# Altium schematic sheet 5.1 LC SEC Relay control.SchDoc
size A3
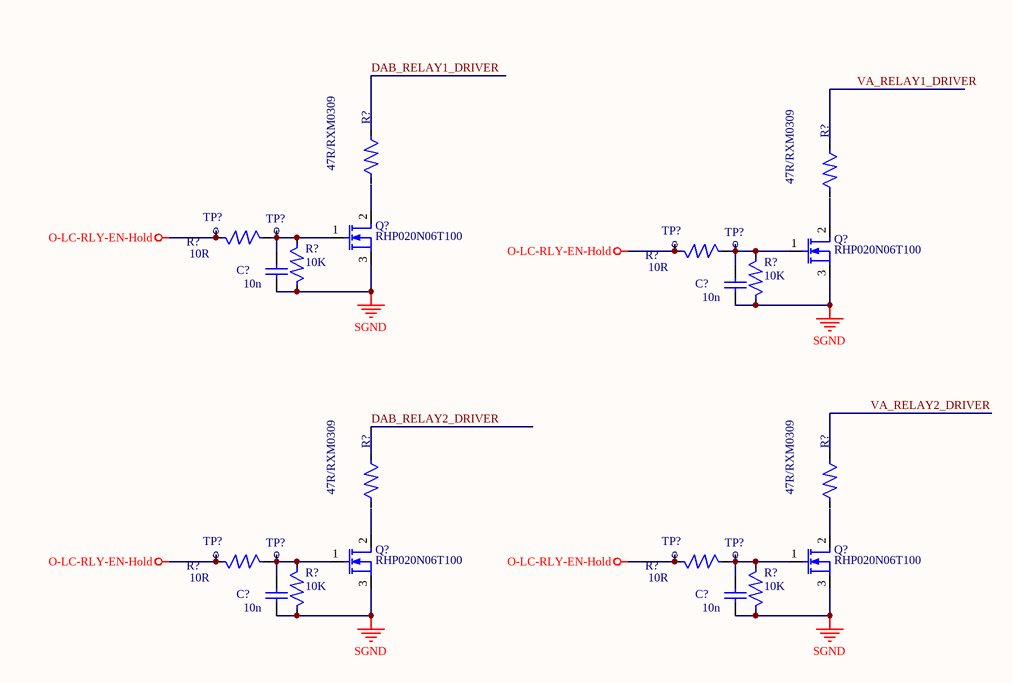
[diagram p0: 5.1 LC SEC Relay control.SchDoc]

## Parts
(Parts that share a designator on the sheet are numbered #1, #2 ... from top to bottom, then left to right.)
C?#1  10n  [C0402]
C?#2  10n  [C0402]
C?#3  10n  [C0402]
C?#4  10n  [C0402]
Q?#1  RHP020N06T100  [SOT89_MI]
Q?#2  RHP020N06T100  [SOT89_MI]
Q?#3  RHP020N06T100  [SOT89_MI]
Q?#4  RHP020N06T100  [SOT89_MI]
R?#1  47R/RXM0309  [RXM0309]
R?#2  47R/RXM0309  [RXM0309]
R?#3  10R  [R0402]
R?#4  10K  [R0402]
R?#5  10R  [R0402]
R?#6  10K  [R0402]
R?#7  47R/RXM0309  [RXM0309]
R?#8  47R/RXM0309  [RXM0309]
R?#9  10R  [R0402]
R?#10  10K  [R0402]
R?#11  10R  [R0402]
R?#12  10K  [R0402]
TP?#1  测试点  [测试点]  (value not drawn)
TP?#2  测试点  [测试点]  (value not drawn)
TP?#3  测试点  [测试点]  (value not drawn)
TP?#4  测试点  [测试点]  (value not drawn)
TP?#5  测试点  [测试点]  (value not drawn)
TP?#6  测试点  [测试点]  (value not drawn)
TP?#7  测试点  [测试点]  (value not drawn)
TP?#8  测试点  [测试点]  (value not drawn)

## Nets
O-LC-RLY-EN-Hold: R?#3.2 R?#5.2 R?#9.2 R?#11.2 TP?#1.1 TP?#3.1 TP?#5.1 TP?#7.1
SGND: C?#1.2 C?#2.2 C?#3.2 C?#4.2 Q?#1.3(S) Q?#2.3(S) Q?#3.3(S) Q?#4.3(S) R?#4.2 R?#6.2 R?#10.2 R?#12.2
DAB_RELAY1_DRIVER: R?#1.1
DAB_RELAY2_DRIVER: R?#7.1
VA_RELAY1_DRIVER: R?#2.1
VA_RELAY2_DRIVER: R?#8.1
NetC?#1_1: C?#1.1 Q?#1.1(G) R?#3.1 R?#4.1 TP?#2.1
NetC?#2_1: C?#2.1 Q?#2.1(G) R?#5.1 R?#6.1 TP?#4.1
NetC?#3_1: C?#3.1 Q?#3.1(G) R?#9.1 R?#10.1 TP?#6.1
NetC?#4_1: C?#4.1 Q?#4.1(G) R?#11.1 R?#12.1 TP?#8.1

Not connected (* = marked no-connect by the designer): Q?#1 2(D); Q?#2 2(D); Q?#3 2(D); Q?#4 2(D); R?#1 2; R?#2 2; R?#7 2; R?#8 2

## Library data of the parts
C?#1-C?#4 = CAP: value: 10n; Parameter: 10n
Q?#1-Q?#4 = MOSFET_N CHANNEL: N MOS FET; DIP/SMD: SMD; Top/Bottom: Bottom; VALUE: RHP020N06T100; BQ-CCCP: BQ-CCCP; Parameter: RHP020N06T100
R?#1 R?#2 R?#7 R?#8 = RESISTOR_1210: RESISTOR; DIP/SMD: SMD; Top/Bottom: Top
R?#3 R?#5 R?#9 R?#11 = RESISTOR_1206: 10R 1% 厚膜 1/16W 0402 YAGEO; DIP/SMD: SMD; Top/Bottom: Bottom; VALUE: 10R; Part Number: *; Parameter: 10R
R?#4 R?#6 R?#10 R?#12 = RESISTOR_1206: 10K 1% 厚膜 1/16W 0402 YAGEO; DIP/SMD: SMD; Top/Bottom: Bottom; VALUE: 10K; Part Number: *; Parameter: 10K
TP?#1-TP?#8 = 测试点: Parameter: 测试点